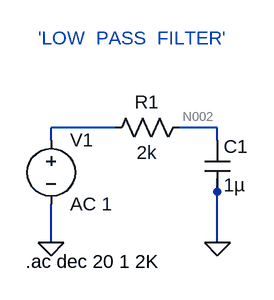
[diagram p0: schematic 1.Lowpass filter.asc]
1.Lowpass filter.asc, the LTspice schematic file:
Version 4
SHEET 1 880 680
WIRE 160 48 80 48
WIRE 288 48 240 48
WIRE 80 64 80 48
WIRE 288 64 288 48
WIRE 288 128 288 112
WIRE 80 192 80 144
WIRE 288 192 288 128
FLAG 80 192 0
FLAG 288 192 0
SYMBOL voltage 80 48 R0
SYMATTR InstName V1
SYMATTR Value AC 1
SYMBOL res 256 32 R90
WINDOW 0 0 56 VBottom 2
WINDOW 3 32 56 VTop 2
SYMATTR InstName R1
SYMATTR Value 2k
SYMBOL cap 272 64 R0
SYMATTR InstName C1
SYMATTR Value 1µ
TEXT 64 -64 Left 2 ;'LOW  PASS  FILTER'
TEXT 48 216 Left 2 !.ac dec 20 1 2K

The netlist it stands for:
* 1.Lowpass filter.asc
V1 N001 0 AC 1
R1 N002 N001 2k
C1 N002 0 1µ
* 'LOW  PASS  FILTER'
.ac dec 20 1 2K
.backanno
.end

* Results of the author's LTspice run, read from the files saved beside the schematic
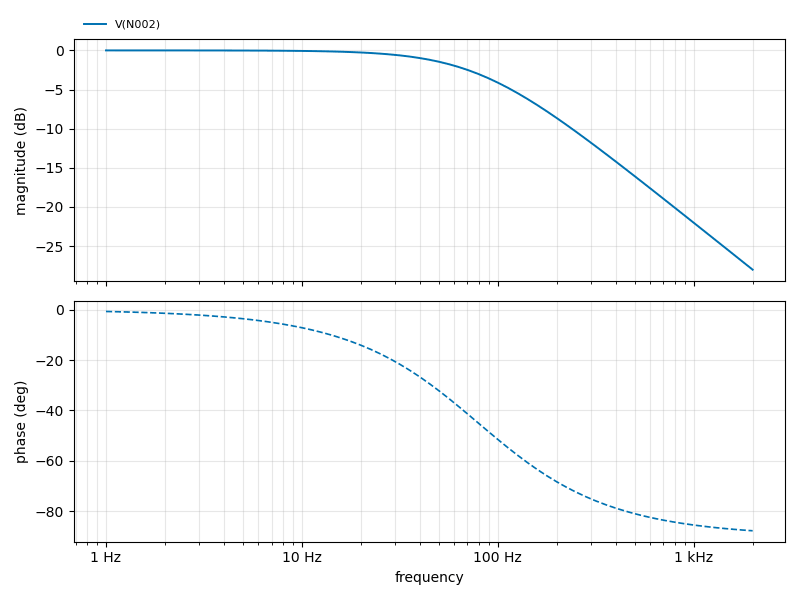
[diagram p1: AC Analysis of 1.Lowpass filter.asc, plotted from the saved traces]
* AC Analysis, 1 run:
*   V(N002): -0.00 dB at 1 Hz, -28.01 dB at 2 kHz, peak -0.00 dB at 1 Hz, 3 dB below the peak at 79.58 Hz